# Altium schematic sheet MCU.SchDoc
size A4; SheetNumber: 2; SheetTotal: 4
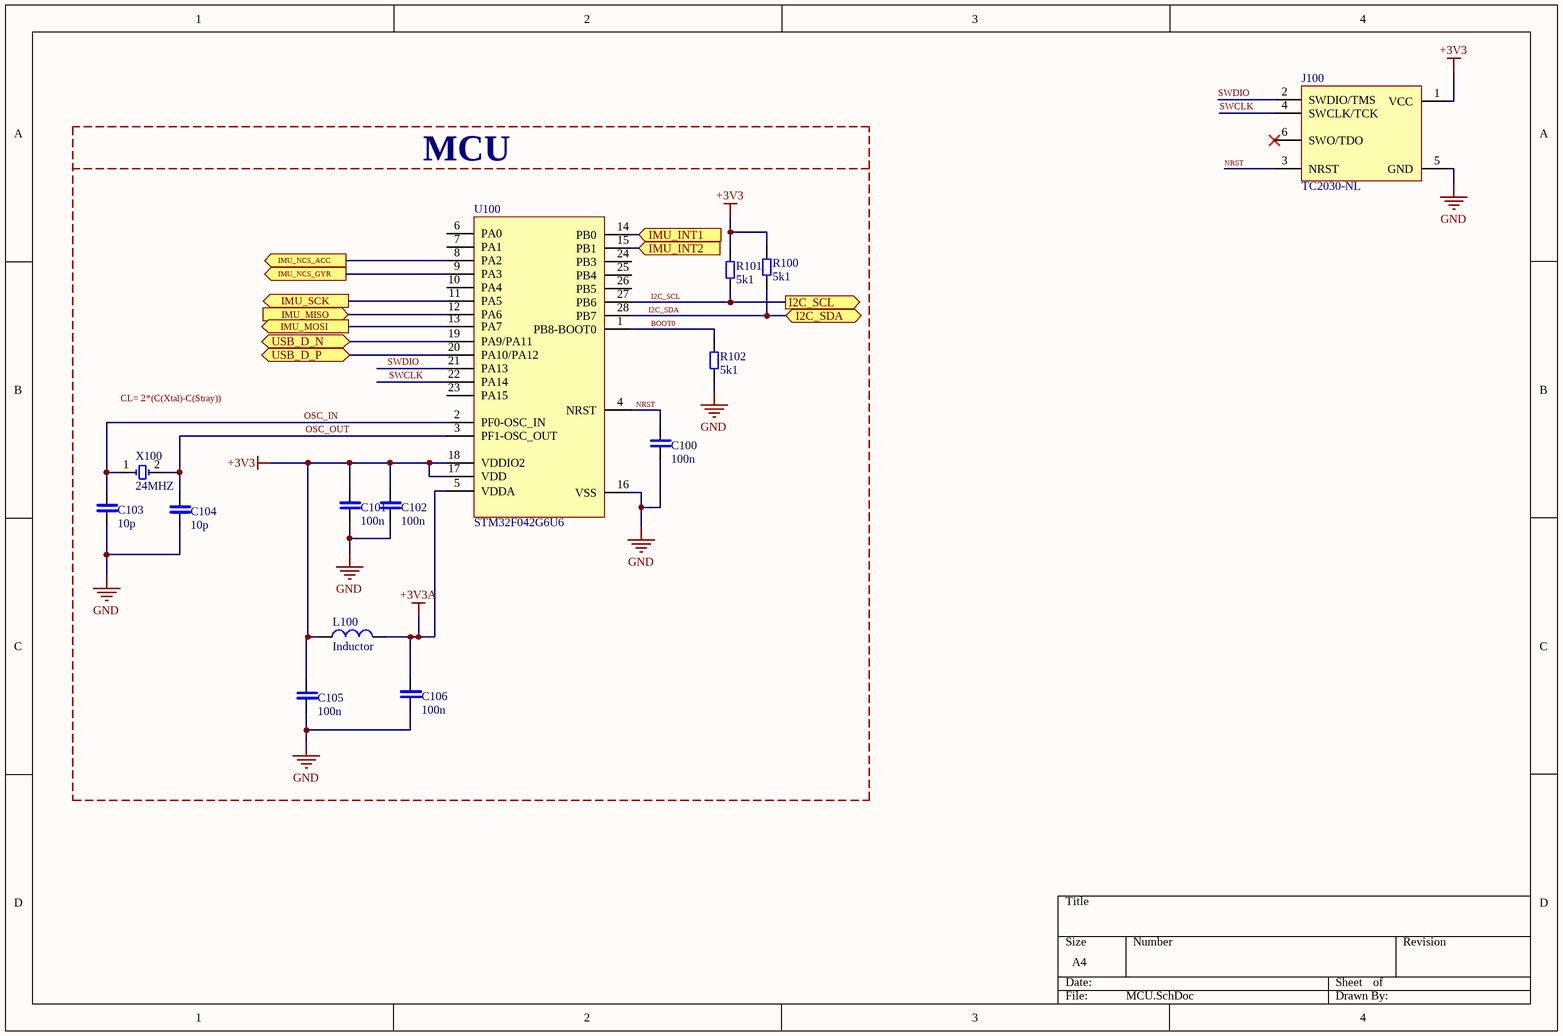
[diagram p0: MCU.SchDoc]

## Parts
C100  100n  [CAP-0805-NP0]
C101  100n  [CAP-0805-NP0]
C102  100n  [CAP-0805-NP0]
C103  10p  [CAP-0805-NP0]
C104  10p  [CAP-0805-NP0]
C105  100n  [CAP-0805-NP0]
C106  100n  [CAP-0805-NP0]
J100  TC2030-NL  [TC2030-NL-FP]
L100  Inductor  [IND_0603]
R100  5k1  [RES-0603]
R101  5k1  [RES-0603]
R102  5k1  [RES-0603]
U100  STM32F042G6U6  [STM32F042G6U6]
X100  24MHZ  [ABM7-8MHZ]

## Blocks framed on the sheet
MCU: C100-C106 L100 R100-R102 U100 X100

## Ports
I2C_SCL (out), I2C_SDA (bidir), IMU_INT1 (in), IMU_INT2 (in), IMU_MISO (in), IMU_MOSI (out), IMU_NCS_ACC (out), IMU_NCS_GYR (out), IMU_SCK (out), USB_D_N (bidir), USB_D_P (bidir)

## Nets
+3V3: C101.1 C102.1 C105.1 J100.1(VCC) L100.1 R100.2 R101.2 U100.17(VDD) U100.18(VDDIO2)
+3V3A: C106.1 L100.2 U100.5(VDDA)
GND: C100.2 C101.2 C102.2 C103.2 C104.2 C105.2 C106.2 J100.5(GND) R102.1 U100.16(VSS)
BOOT0: R102.2 U100.1(PB8-BOOT0)
I2C_SCL: R101.1 U100.27(PB6) ; port I2C_SCL
I2C_SDA: R100.1 U100.28(PB7) ; port I2C_SDA
IMU_INT1: U100.14(PB0) ; port IMU_INT1
IMU_INT2: U100.15(PB1) ; port IMU_INT2
IMU_MISO: U100.12(PA6) ; port IMU_MISO
IMU_MOSI: U100.13(PA7) ; port IMU_MOSI
IMU_NCS_ACC: U100.8(PA2) ; port IMU_NCS_ACC
IMU_NCS_GYR: U100.9(PA3) ; port IMU_NCS_GYR
IMU_SCK: U100.11(PA5) ; port IMU_SCK
NRST: C100.1 J100.3(NRST) U100.4(NRST)
OSC_IN: C103.1 U100.2(PF0-OSC_IN) X100.1
OSC_OUT: C104.1 U100.3(PF1-OSC_OUT) X100.2
SWCLK: J100.4(SWCLK/TCK) U100.22(PA14)
SWDIO: J100.2(SWDIO/TMS) U100.21(PA13)
USB_D_N: U100.19(PA9/PA11) ; port USB_D_N
USB_D_P: U100.20(PA10/PA12) ; port USB_D_P

Not connected (* = marked no-connect by the designer): J100 6(SWO/TDO)*; U100 6(PA0) 7(PA1) 10(PA4) 23(PA15) 24(PB3) 25(PB4) 26(PB5)

## Notes on the sheet
- (near J100) P>Directives>Geneic No ERC
- CL= 2*(C(Xtal)-C(Stray))

## Library data of the parts
C100-C106 = CAP-0805-NP0-27pF: Surface Mount Ceramic Multilayer Capacitor 27pF 1% C0G 50V 0805 Paper T/R; Manufacturer: Yageo; Manufacturer Part Number: CC0805FRNPO9BN270; Supplier 1: Digi-Key; RoHS: Yes; Category: Ceramic Capacitors; Stock 1: 10598; Pricing 1: 1=0,30000, 10=0,20400, 50=0,12260, 100=0,10350, 500=0,07082, 1000=0,06264 (USD); Mount: Surface Mount; Case/Package: 0805; Case Code (Imperial): 0805; Case Code (Metric): 2012; Weight: 0.000194oz; Min Operating Temperature: -55°C; Max Operating Temperature: 125°C; Capacitance: 27pF; Tolerance: 1%; Dielectric: C0G; Voltage Rating: 50V; Packaging: Tape and Reel; Voltage Rating (DC): 50V; Termination: SMD/SMT; Resistor Type: Ceramic; Series: CC; Length: 2mm; Width: 0.049inch; Height: 0.6mm; Depth: 1.25mm; Thickness: 0.028inch; Lead Free: Lead Free; RoHS Compliant: Yes; ComponentLink1URL: https://datasheet.ciiva.com/11465/upy-gp-np0-16v-to-50v-8-11465135.pdf?src-supplier=Avnet; ComponentLink1Description: https://datasheet.ciiva.com/11465/upy-gp-np0-16v-to-50v-8-11465135.pdf?src-supplier=Avnet; ComponentLink2URL: https://datasheet.ciiva.com/17436/upy-gp-np0-16v-to-50v-8-17436811.pdf?src-supplier=Avnet+Europe; ComponentLink2Description: https://datasheet.ciiva.com/17436/upy-gp-np0-16v-to-50v-8-17436811.pdf?src-supplier=Avnet+Europe; Supplier Part Number 1: 311-4173-1-ND
R100-R102 = RES-0603-1k: 贴片电阻 1000Ω ± 1.00% 0.1W ± 100ppm/℃ 0603; Manufacturer: Vishay Dale; Manufacturer Part Number: CRCW06031K00FKEA; Resistance: 1kR; Power Rating: 100mW; Temperature Coefficient: 100ppm/°C; Tolerance: 1%; Voltage Rating: 75V; Supplier 1: Newark; RoHS: Yes; Category: Chip SMD Resistors; Pricing 1: 1=0,12500, 10=0,05300, 25=0,04300, 50=0,03100, 100=0,02100 (USD); Mount: Surface Mount; Case/Package: 0603; Number of Pins: 2; Case Code (Metric): 1608; Case Code (Imperial): 0603; Contact Plating: Tin; Size Code: 0603; Weight: 7.1E-05oz; Min Operating Temperature: -55°C; Max Operating Temperature: 155°C; Packaging: Tape and Reel; Max Power Dissipation: 100mW; Series: CRCW; Resistor Type: Thick Film; Package Quantity: 10; Number of Terminations: 2; Termination: SMD/SMT; Features: Automotive AEC-Q200; Construction: Rectangular; Voltage Rating (DC): 75V; Resistance Tolerance: 1%; Technology: THICK FILM; Length: 1.55mm; Width: 0.033inch; Height: 0.45mm; Depth: 0.85mm; Radiation Hardening: No; Lead Free: Lead Free; RoHS Compliant: Yes; Military Standard: Not; REACH SVHC: Unknown; ComponentLink1URL: https://datasheet.ciiva.com/11808/0900766b80d98afc-11808625.pdf?src-supplier=RSComponents; ComponentLink1Description: https://datasheet.ciiva.com/11808/0900766b80d98afc-11808625.pdf?src-supplier=RSComponents; ComponentLink2URL: https://datasheet.ciiva.com/46441/1720486-46441623.pdf?src-supplier=Element14; ComponentLink2Description: https://datasheet.ciiva.com/46441/1720486-46441623.pdf?src-supplier=Element14; ComponentLink3URL: https://datasheet.ciiva.com/46441/1720486-46441622.pdf?src-supplier=Element14; ComponentLink3Description: https://datasheet.ciiva.com/46441/1720486-46441622.pdf?src-supplier=Element14; ComponentLink4URL: https://datasheet.ciiva.com/26316/fld-crcw-e3-data-en-26316551.pdf?src-supplier=Distrelec; ComponentLink4Description: https://datasheet.ciiva.com/26316/fld-crcw-e3-data-en-26316551.pdf?src-supplier=Distrelec; ComponentLink5URL: https://datasheet.ciiva.com/46385/1697337-46385497.pdf?src-supplier=Element14; ComponentLink5Description: https://datasheet.ciiva.com/46385/1697337-46385497.pdf?src-supplier=Element14; ComponentLink6URL: https://datasheet.ciiva.com/2465/dcrcwe3-2465535.pdf?src-supplier=Digi-Key; ComponentLink6Description: https://datasheet.ciiva.com/2465/dcrcwe3-2465535.pdf?src-supplier=Digi-Key; ComponentLink7URL: https://datasheet.ciiva.com/2465/dcrcwe3-2465536.pdf?src-supplier=Digi-Key; ComponentLink7Description: https://datasheet.ciiva.com/2465/dcrcwe3-2465536.pdf?src-supplier=Digi-Key; ComponentLink8URL: https://datasheet.ciiva.com/2465/dcrcwe3-2465534.pdf?src-supplier=Digi-Key; ComponentLink8Description: https://datasheet.ciiva.com/2465/dcrcwe3-2465534.pdf?src-supplier=Digi-Key; ComponentLink9URL: https://datasheet.ciiva.com/16515/dcrcwe3-16515078.pdf?src-supplier=Avnet+Asia; ComponentLink9Description: https://datasheet.ciiva.com/16515/dcrcwe3-16515078.pdf?src-supplier=Avnet+Asia; ComponentLink10URL: https://datasheet.ciiva.com/8336/dcrcwe3-8336822.pdf?src-supplier=Avnet; ComponentLink10Description: https://datasheet.ciiva.com/8336/dcrcwe3-8336822.pdf?src-supplier=Avnet; ComponentLink11URL: https://datasheet.ciiva.com/16199/dcrcwe3-16199053.pdf?src-supplier=Future+Electronics; ComponentLink11Description: https://datasheet.ciiva.com/16199/dcrcwe3-16199053.pdf?src-supplier=Future+Electronics; ComponentLink12URL: https://datasheet.ciiva.com/16893/dcrcwe3-16893742.pdf?src-supplier=Avnet+Europe; ComponentLink12Description: https://datasheet.ciiva.com/16893/dcrcwe3-16893742.pdf?src-supplier=Avnet+Europe; ComponentLink13URL: https://datasheet.ciiva.com/3257/dcrcwe3-3257132.pdf?src-supplier=Avnet; ComponentLink13Description: https://datasheet.ciiva.com/3257/dcrcwe3-3257132.pdf?src-supplier=Avnet; Supplier Part Number 1: 61M5328
U100 = STM32F042G6U6: MCU 32-Bit STM32F ARM Cortex M0 RISC 32KB Flash 2.5V/3.3V 28-Pin UFQFPN Tray; Manufacturer: STMicroelectronics; Interface: I2C,SPI,USB,CAN,HDMI,IrDA,UART,USART,LIN,I2S; Number of I/Os: 24; Frequency: 48MHz; Oscillator Type: Internal; Peripherals: POR,PWM,WDT,DMA; RAM Size: 6KB; Max Power Dissipation: 170mW; Number of Timers/Counters: 6; Min Supply Voltage: 2V; Max Supply Voltage: 3.6V; Data Bus Width: 32b; Watchdog Timer: Yes; Number of ADC Channels: 13; Supplier 1: Farnell; Manufacturer Part Number: STM32F042G6U6; RoHS: Yes; Category: Microcontrollers; Pricing 1: 1=4,49000, 10=4,05000, 25=3,82000, 50=3,74000 (EUR); Mount: Surface Mount; Case/Package: UFQFPN; Number of Pins: 28; Min Operating Temperature: -40°C; Max Operating Temperature: 85°C; Packaging: Tray; Memory Type: FLASH; Memory Size: 32KB; Core Architecture: ARM; Number of Programmable I/O: 24; Max Frequency: 48MHz; Package Quantity: 2940; Radiation Hardening: No; RoHS Compliant: Yes; REACH SVHC: No SVHC; Lead Free: Lead Free; ComponentLink1URL: https://datasheet.ciiva.com/48494/dm00105814-48494126.pdf?src-supplier=Avnet; ComponentLink1Description: https://datasheet.ciiva.com/48494/dm00105814-48494126.pdf?src-supplier=Avnet; Supplier Part Number 1: 2469551
X100 = ABM7-8MHZ: Crystal 8MHz ±20ppm (Tol) ±30ppm (Stability) 18pF FUND 100Ohm 2-Pin Mini-CSMD T/R; Manufacturer: Abracon; Manufacturer Part Number: ABM7-8.000MHZ-D2Y-T; ESR (Equivalent Series Resistance): 100R; Series Resistance: 80R; Supplier 1: Digi-Key; RoHS: Yes; Category: Crystals; Pricing 1: 1=0,87000, 10=0,77300, 50=0,72240, 100=0,63840, 500=0,60480 (USD); Mount: Surface Mount; Case/Package: CSMD; Number of Pins: 2; Min Operating Temperature: -40°C; Max Operating Temperature: 85°C; Frequency: 8MHz; Frequency Tolerance: 20ppm; Load Capacitance: 18pF; Packaging: Tape and Reel; Frequency Stability: 30ppm; Package Quantity: 1000; Tolerance: 20ppm; Termination: SMD/SMT; Resistor Type: Ceramic; Length: 6mm; Width: 0.138inch; Height: 0.055inch; Depth: 3.5mm; Radiation Hardening: No; REACH SVHC: Yes; Lead Free: Lead Free; ComponentLink1URL: https://datasheet.ciiva.com/15116/getdatasheetpartid-722403-15116844.pdf?src-supplier=Verical; ComponentLink1Description: https://datasheet.ciiva.com/15116/getdatasheetpartid-722403-15116844.pdf?src-supplier=Verical; ComponentLink2URL: https://datasheet.ciiva.com/1357/1718755-1357277.pdf?src-supplier=Element14; ComponentLink2Description: https://datasheet.ciiva.com/1357/1718755-1357277.pdf?src-supplier=Element14; ComponentLink3URL: https://datasheet.ciiva.com/4944/abm7-19096-4944987.pdf?src-supplier=Mouser; ComponentLink3Description: https://datasheet.ciiva.com/4944/abm7-19096-4944987.pdf?src-supplier=Mouser; ComponentLink4URL: https://datasheet.ciiva.com/29998/abm7-29998171.pdf?src-supplier=Avnet; ComponentLink4Description: https://datasheet.ciiva.com/29998/abm7-29998171.pdf?src-supplier=Avnet; ComponentLink5URL: https://datasheet.ciiva.com/16416/abm7-16416924.pdf?src-supplier=Future+Electronics; ComponentLink5Description: https://datasheet.ciiva.com/16416/abm7-16416924.pdf?src-supplier=Future+Electronics; Supplier Part Number 1: 535-9831-6-ND